# Altium schematic sheet Comms.SchDoc
size A; SheetNumber: 2; SheetTotal: 5
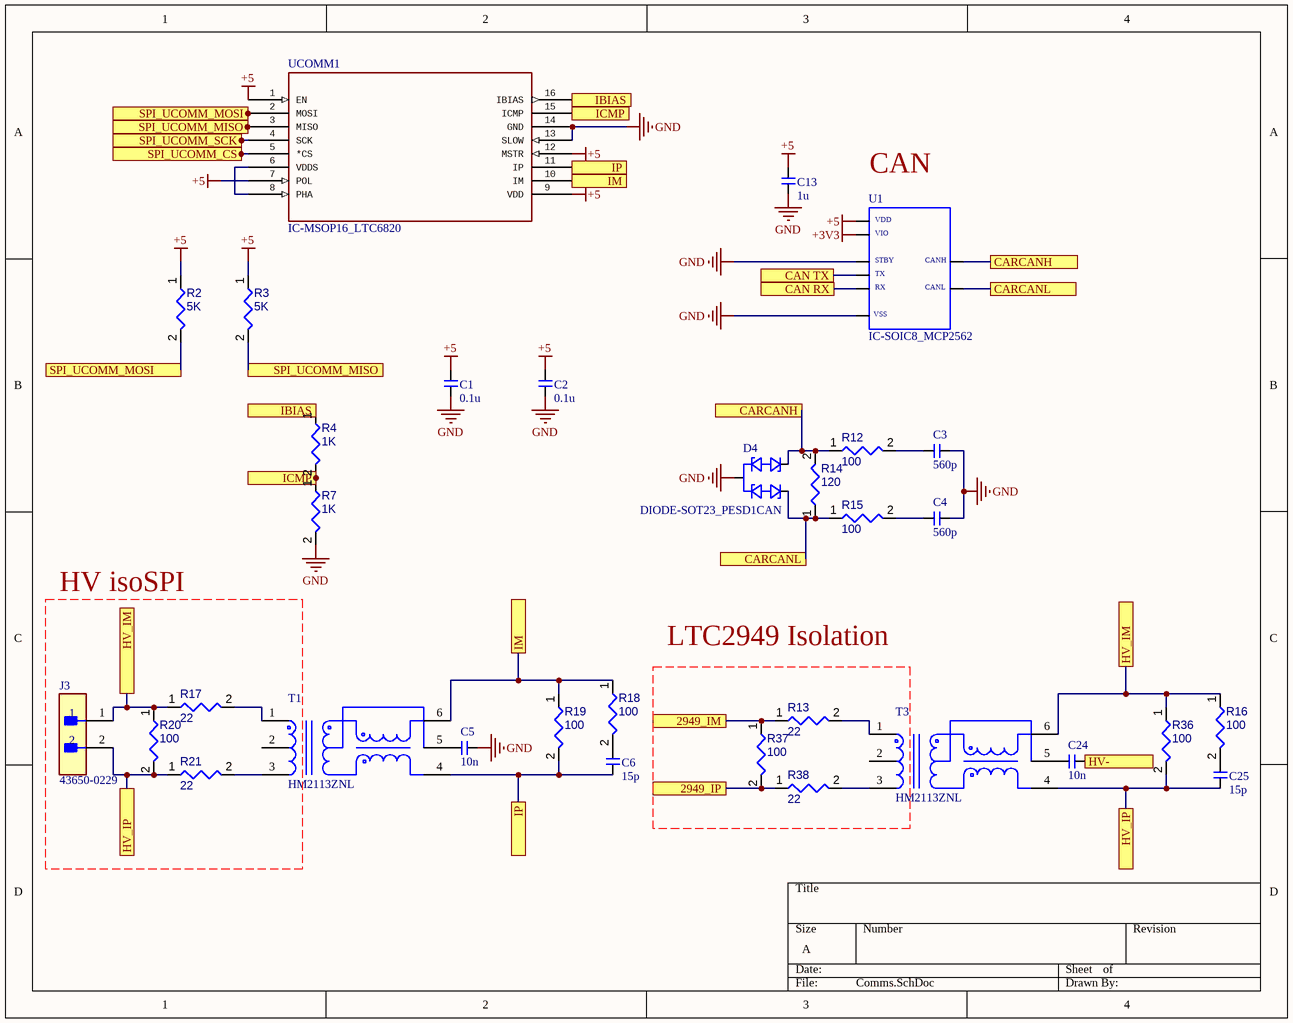
[diagram p0: Comms.SchDoc]

## Parts
C1  0.1u  [CAP-0603]
C2  0.1u  [CAP-0603]
C3  560p  [CAP-0603]
C4  560p  [CAP-0603]
C5  10n  [CAP-0603]
C6  15p  [CAP-0603]
C13  1u  [CAP-0603]
C24  10n  [CAP-0603]
C25  15p  [CAP-0603]
D4  DIODE-SOT23_PESD1CAN  [SOT23]
J3  43650-0229  [FP-43650-0229-MFG]
R2  5K  [RESC0805(2012)_L]
R3  5K  [RESC0805(2012)_L]
R4  1K  [RESC0805(2012)_L]
R7  1K  [RESC0805(2012)_L]
R12  100  [RESC0805(2012)_L]
R13  22  [RESC0805(2012)_L]
R14  120  [RESC0805(2012)_L]
R15  100  [RESC0805(2012)_L]
R16  100  [RESC0805(2012)_L]
R17  22  [RESC0805(2012)_L]
R18  100  [RESC0805(2012)_L]
R19  100  [RESC0805(2012)_L]
R20  100  [RESC0805(2012)_L]
R21  22  [RESC0805(2012)_L]
R36  100  [RESC0805(2012)_L]
R37  100  [RESC0805(2012)_L]
R38  22  [RESC0805(2012)_L]
T1  HM2113ZNL  [FP-HM2113ZNL-MFG]
T3  HM2113ZNL  [FP-HM2113ZNL-MFG]
U1  IC-SOIC8_MCP2562  [SOIC8]
UCOMM1  IC-MSOP16_LTC6820  [MSOP16]

## Ports
2949_IM, 2949_IP, CAN RX, CAN TX, CARCANH, CARCANL, HV-, HV_IM, HV_IP, IBIAS, ICMP, IM, IP, SPI_UCOMM_CS, SPI_UCOMM_MISO, SPI_UCOMM_MOSI, SPI_UCOMM_SCK

## Nets
+3V3: U1.5
+5: C1.2 C2.2 C13.1 R2.1 R3.1 U1.3 UCOMM1.1(EN) UCOMM1.7(POL) UCOMM1.9(VDD) UCOMM1.12(MSTR)
GND: C1.1 C2.1 C3.1 C4.1 C5.1 C13.2 D4.3(G) R7.2 U1.2 U1.8 UCOMM1.13(SLOW) UCOMM1.14(GND)
2949_IM: R13.1 R37.1 ; port 2949_IM
2949_IP: R37.2 R38.1 ; port 2949_IP
CAN RX: U1.4 ; port CAN RX
CAN TX: U1.1 ; port CAN TX
CARCANH: D4.2(CAN2) R12.1 R14.2 U1.7 ; port CARCANH
CARCANL: D4.1(CAN1) R14.1 R15.1 U1.6 ; port CARCANL
HV-: C24.1 ; port HV-
HV_IM: J3.1 R16.1 R17.1 R20.1 R36.1 T3.6 ; port HV_IM
HV_IP: C25.2 J3.2 R20.2 R21.1 R36.2 T3.4 ; port HV_IP
IBIAS: R4.1 UCOMM1.16(IBIAS) ; port IBIAS
ICMP: R4.2 R7.1 UCOMM1.15(ICMP) ; port ICMP
IM: R18.1 R19.1 T1.6 UCOMM1.10(IM) ; port IM
IP: C6.2 R19.2 T1.4 UCOMM1.11(IP) ; port IP
SPI_UCOMM_CS: UCOMM1.5(*CS) ; port SPI_UCOMM_CS
SPI_UCOMM_MISO: R3.2 UCOMM1.3(MISO) ; port SPI_UCOMM_MISO
SPI_UCOMM_MOSI: R2.2 UCOMM1.2(MOSI) ; port SPI_UCOMM_MOSI
SPI_UCOMM_SCK: UCOMM1.4(SCK) ; port SPI_UCOMM_SCK
NetC3_2: C3.2 R12.2
NetC4_2: C4.2 R15.2
NetC5_2: C5.2 T1.5
NetC6_1: C6.1 R18.2
NetC24_2: C24.2 T3.5
NetC25_1: C25.1 R16.2
NetR13_2: R13.2 T3.1
NetR17_2: R17.2 T1.1
NetR21_2: R21.2 T1.3
NetR38_2: R38.2 T3.3
NetUCOMM1_6: UCOMM1.6(VDDS) UCOMM1.8(PHA)

Not connected (* = marked no-connect by the designer): T1 2; T3 2

## Notes on the sheet
- (near U1) CAN
- HV isoSPI
- LTC2949 Isolation
- (in symbol CMP-056-000408-1) VDD; VIO; STBY; CANH; TX; RX; CANL; VSS

## Library data of the parts
C1-C6 C13 C24 C25 = CMP-050-000018-1: Design Item ID: CAP-0603; Source: ife19_Elec_Library.SchLib
D4 = CMP-051-000054-1: Source: ife19_Elec_Library.SchLib; Design Item ID: DIODE-SOT23_PESD1CAN
J3 = CMP-04776-000041-1: CONN HEADER VERT 2POS 3MM; Manufacturer: Molex; Voltage Rating: 600V; Conn Orientation: Vertical; Conn Gender: Male; Number Of Contacts: 2; Current Rating: 8.5A; ComponentLink2URL: https://www.molex.com/webdocs/datasheets/pdf/en-us/0436500229_PCB_HEADERS.pdf; ComponentLink2Description: Datasheet; Mouser Description: Headers & Wire Housings MicroFit 3.0 SR V TH Peg 30Au 2Ckt; Category: Conn; Height: 10.15mm; Contact Material: Gold,Nickel; Octopart: https://octopart.com/43650-0229-molex-7652326; Manufacturer Part Number: 43650-0229; Device Class L3: unset; Digikey Description: CONN HEADER VERT 2POS 3MM; Temperature Range Low: -40°C; Temperature Range High: +105°C; Pitch: 3mm; Package: 0; RoHS: TRUE; Device Class L1: Connectors; Lead Free: Yes; Temperature: -40°C to +105°C; Number Of Rows: 1; Automotive: No; Device Class L2: Headers and Wire Housings; Footprint Url: https://www.molex.com/pdm_docs/sd/436500229_sd.pdf
R2-R4 R7 R12-R21 R36-R38 = CMP-009-000150-1: Chip Resistor, 43,2 kOhms, +/-1 %, 63 mW, -55 to 155 degC, 0402; Available Preview Images: 2D; Source: Integrated_Library - 12.03.21 - 15.39.SchLib; Design Item ID: CMP-009-00154-2
T1 T3 = CMP-16309-000063-1: XFMR CMC MODULE AECQ BATT MNGT; Manufacturer: Pulse; Primary Resistance: 0.45Ω; Automotive Grade: Grade 1; Standoff Height: 0.25mm; Sec Resistance: 0.85Ω; Inductance Primary: 150uH; Return Loss: 20dB; Turns Ratio: 1:1; Isolation Voltage: 4300VDC; Insertion Loss: 0.25dB; Temperature Range Low: -40°C; Device Class L3: unset; Package: HM2113ZNL; Digikey Description: XFMR CMC MODULE AECQ BATT MNGT; ComponentLink2Description: Datasheet; Category: Trans; Lead Free: Yes; Automotive: Yes; RoHS: TRUE; Octopart: https://octopart.com/hm2113znl-pulse-88018493; ComponentLink2URL: https://productfinder.pulseeng.com/doc_type/WEB301/doc_num/HM2113ZNL/doc_part/HM2113ZNL.pdf; Temperature Range High: +125°C; Temperature: -40°C to +125°C; Device Class L1: Passive Components; Manufacturer Part Number: HM2113ZNL; Device Class L2: Transformers; Height: 3.45mm
U1 = CMP-056-000408-1: Source: ife19_Elec_Library.SchLib; Design Item ID: IC-SOIC8_MCP2562
UCOMM1 = CMP-056-000410-1: Source: ife19_Elec_Library.SchLib; Design Item ID: IC-MSOP16_LTC6820